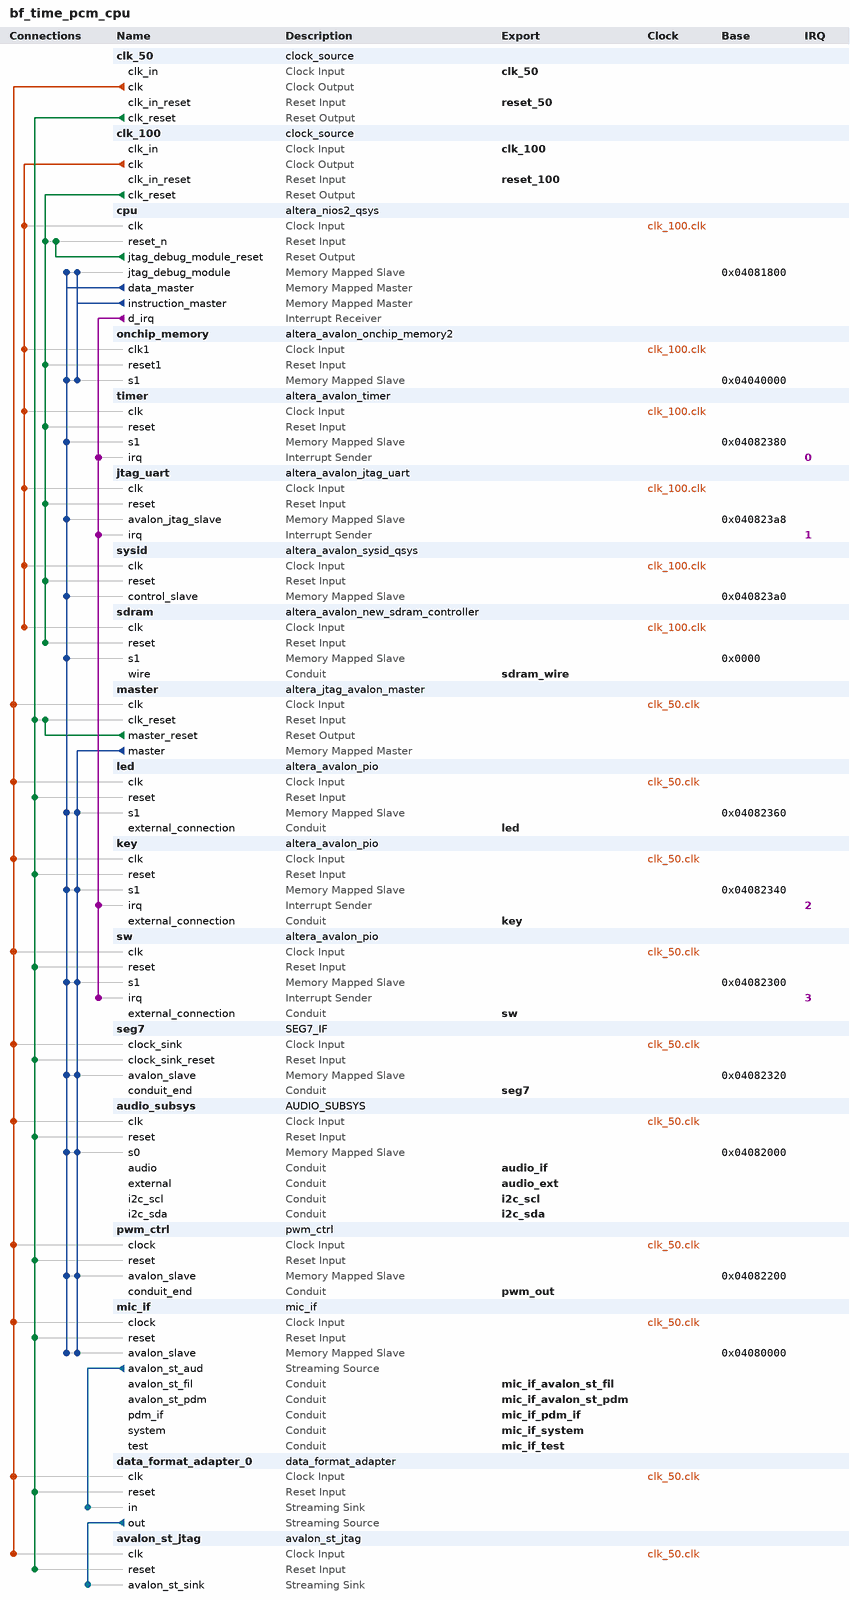
[diagram p0: system contents]
# Platform Designer (Qsys) system bf_time_pcm_cpu, Stratix III Unknown
# Parameters at their usual value, and those the tool derives, are not listed.
package require -exact qsys 13.0.1.99.2
create_system bf_time_pcm_cpu
set_project_property DEVICE_FAMILY {Stratix III}
set_project_property DEVICE Unknown

add_instance clk_50 clock_source 13.0
set_instance_parameter_value clk_50 clockFrequency 50000000

add_instance clk_100 clock_source 13.0
set_instance_parameter_value clk_100 clockFrequency 100000000

add_instance cpu altera_nios2_qsys 13.0
set_instance_parameter_value cpu resetSlave onchip_memory.s1
set_instance_parameter_value cpu mmu_TLBMissExcSlave None
set_instance_parameter_value cpu exceptionSlave onchip_memory.s1
set_instance_parameter_value cpu breakSlave cpu.jtag_debug_module
set_instance_parameter_value cpu muldiv_multiplierType NoneSmall
set_instance_parameter_value cpu impl Fast
set_instance_parameter_value cpu icache_size 4096

add_instance onchip_memory altera_avalon_onchip_memory2 13.0.1.99.2
set_instance_parameter_value onchip_memory dataWidth 32
set_instance_parameter_value onchip_memory dualPort false
set_instance_parameter_value onchip_memory initMemContent true
set_instance_parameter_value onchip_memory initializationFileName onchip_mem.hex
set_instance_parameter_value onchip_memory memorySize 160000

add_instance timer altera_avalon_timer 13.0.1.99.2
set_instance_parameter_value timer period 1
set_instance_parameter_value timer periodUnits MSEC

add_instance jtag_uart altera_avalon_jtag_uart 13.0.1.99.2
set_instance_parameter_value jtag_uart simInteractiveOptions NO_INTERACTIVE_WINDOWS

add_instance sysid altera_avalon_sysid_qsys 13.0
set_instance_parameter_value sysid id 0

add_instance sdram altera_avalon_new_sdram_controller 13.0.1.99.2
set_instance_parameter_value sdram TAC 5.5
set_instance_parameter_value sdram TRCD 20.0
set_instance_parameter_value sdram TRP 20.0
set_instance_parameter_value sdram casLatency 3
set_instance_parameter_value sdram columnWidth 10
set_instance_parameter_value sdram dataWidth 16
set_instance_parameter_value sdram generateSimulationModel true
set_instance_parameter_value sdram model single_Micron_MT48LC4M32B2_7_chip
set_instance_parameter_value sdram numberOfBanks 4
set_instance_parameter_value sdram numberOfChipSelects 1
set_instance_parameter_value sdram powerUpDelay 100.0
set_instance_parameter_value sdram refreshPeriod 15.625
set_instance_parameter_value sdram rowWidth 13

add_instance master altera_jtag_avalon_master 13.0

add_instance led altera_avalon_pio 13.0.1.99.2
set_instance_parameter_value led bitModifyingOutReg true
set_instance_parameter_value led direction Output
set_instance_parameter_value led width 32

add_instance key altera_avalon_pio 13.0.1.99.2
set_instance_parameter_value key bitModifyingOutReg true
set_instance_parameter_value key captureEdge true
set_instance_parameter_value key direction Input
set_instance_parameter_value key edgeType FALLING
set_instance_parameter_value key generateIRQ true
set_instance_parameter_value key irqType EDGE
set_instance_parameter_value key simDoTestBenchWiring true
set_instance_parameter_value key width 4

add_instance sw altera_avalon_pio 13.0.1.99.2
set_instance_parameter_value sw bitModifyingOutReg true
set_instance_parameter_value sw captureEdge true
set_instance_parameter_value sw direction Input
set_instance_parameter_value sw edgeType ANY
set_instance_parameter_value sw generateIRQ true
set_instance_parameter_value sw irqType EDGE
set_instance_parameter_value sw simDoTestBenchWiring true
set_instance_parameter_value sw width 10

add_instance seg7 SEG7_IF 1.0
set_instance_parameter_value seg7 SEG7_NUM 6

add_instance audio_subsys AUDIO_SUBSYS 1.0

add_instance pwm_ctrl pwm_ctrl 1.0
set_instance_parameter_value pwm_ctrl NUM_CH 2
set_instance_parameter_value pwm_ctrl CNT_WIDTH 32

add_instance mic_if mic_if 1.0
set_instance_parameter_value mic_if NUM_CH 4
set_instance_parameter_value mic_if NUM_TAPS 60
set_instance_parameter_value mic_if MAX_CICOSR 63
set_instance_parameter_value mic_if DATA_OUT_WIDTH 16
set_instance_parameter_value mic_if FFTPTS_WIDTH 11
set_instance_parameter_value mic_if BF_INP_PDM false
set_instance_parameter_value mic_if BF_TIME true

add_instance data_format_adapter_0 data_format_adapter 13.0
set_instance_parameter_value data_format_adapter_0 generationLanguage VERILOG
set_instance_parameter_value data_format_adapter_0 inBitsPerSymbol 8
set_instance_parameter_value data_format_adapter_0 inChannelWidth 0
set_instance_parameter_value data_format_adapter_0 inErrorWidth 0
set_instance_parameter_value data_format_adapter_0 inMaxChannel 0
set_instance_parameter_value data_format_adapter_0 inReadyLatency 0
set_instance_parameter_value data_format_adapter_0 inSymbolsPerBeat 2
set_instance_parameter_value data_format_adapter_0 inUseEmpty false
set_instance_parameter_value data_format_adapter_0 inUseEmptyPort AUTO
set_instance_parameter_value data_format_adapter_0 inUsePackets false
set_instance_parameter_value data_format_adapter_0 inUseReady true
set_instance_parameter_value data_format_adapter_0 outSymbolsPerBeat 1
set_instance_parameter_value data_format_adapter_0 outUseEmpty false
set_instance_parameter_value data_format_adapter_0 outUseEmptyPort AUTO

add_instance avalon_st_jtag avalon_st_jtag 1.0

# connections
add_connection clk_50.clk audio_subsys.clk clock
add_connection clk_50.clk avalon_st_jtag.clk clock
add_connection clk_50.clk data_format_adapter_0.clk clock
add_connection clk_50.clk key.clk clock
add_connection clk_50.clk led.clk clock
add_connection clk_50.clk master.clk clock
add_connection clk_50.clk mic_if.clock clock
add_connection clk_50.clk pwm_ctrl.clock clock
add_connection clk_50.clk seg7.clock_sink clock
add_connection clk_50.clk sw.clk clock
add_connection clk_100.clk cpu.clk clock
add_connection clk_100.clk jtag_uart.clk clock
add_connection clk_100.clk onchip_memory.clk1 clock
add_connection clk_100.clk sdram.clk clock
add_connection clk_100.clk sysid.clk clock
add_connection clk_100.clk timer.clk clock
add_connection clk_50.clk_reset audio_subsys.reset reset
add_connection clk_50.clk_reset avalon_st_jtag.reset reset
add_connection clk_50.clk_reset data_format_adapter_0.reset reset
add_connection clk_50.clk_reset key.reset reset
add_connection clk_50.clk_reset led.reset reset
add_connection clk_50.clk_reset master.clk_reset reset
add_connection clk_50.clk_reset mic_if.reset reset
add_connection clk_50.clk_reset pwm_ctrl.reset reset
add_connection clk_50.clk_reset seg7.clock_sink_reset reset
add_connection clk_50.clk_reset sw.reset reset
add_connection clk_100.clk_reset cpu.reset_n reset
add_connection clk_100.clk_reset jtag_uart.reset reset
add_connection clk_100.clk_reset onchip_memory.reset1 reset
add_connection clk_100.clk_reset sdram.reset reset
add_connection clk_100.clk_reset sysid.reset reset
add_connection clk_100.clk_reset timer.reset reset
add_connection cpu.jtag_debug_module_reset cpu.reset_n reset
add_connection master.master_reset master.clk_reset reset
add_connection cpu.data_master audio_subsys.s0 avalon
set_connection_parameter_value cpu.data_master/audio_subsys.s0 baseAddress 0x04082000
add_connection cpu.data_master cpu.jtag_debug_module avalon
set_connection_parameter_value cpu.data_master/cpu.jtag_debug_module baseAddress 0x04081800
add_connection cpu.data_master jtag_uart.avalon_jtag_slave avalon
set_connection_parameter_value cpu.data_master/jtag_uart.avalon_jtag_slave baseAddress 0x040823a8
add_connection cpu.data_master key.s1 avalon
set_connection_parameter_value cpu.data_master/key.s1 baseAddress 0x04082340
add_connection cpu.data_master led.s1 avalon
set_connection_parameter_value cpu.data_master/led.s1 baseAddress 0x04082360
add_connection cpu.data_master mic_if.avalon_slave avalon
set_connection_parameter_value cpu.data_master/mic_if.avalon_slave baseAddress 0x04080000
add_connection cpu.data_master onchip_memory.s1 avalon
set_connection_parameter_value cpu.data_master/onchip_memory.s1 baseAddress 0x04040000
add_connection cpu.data_master pwm_ctrl.avalon_slave avalon
set_connection_parameter_value cpu.data_master/pwm_ctrl.avalon_slave baseAddress 0x04082200
add_connection cpu.data_master sdram.s1 avalon
set_connection_parameter_value cpu.data_master/sdram.s1 baseAddress 0x0000
add_connection cpu.data_master seg7.avalon_slave avalon
set_connection_parameter_value cpu.data_master/seg7.avalon_slave baseAddress 0x04082320
add_connection cpu.data_master sw.s1 avalon
set_connection_parameter_value cpu.data_master/sw.s1 baseAddress 0x04082300
add_connection cpu.data_master sysid.control_slave avalon
set_connection_parameter_value cpu.data_master/sysid.control_slave baseAddress 0x040823a0
add_connection cpu.data_master timer.s1 avalon
set_connection_parameter_value cpu.data_master/timer.s1 baseAddress 0x04082380
add_connection cpu.instruction_master cpu.jtag_debug_module avalon
set_connection_parameter_value cpu.instruction_master/cpu.jtag_debug_module baseAddress 0x04081800
add_connection cpu.instruction_master onchip_memory.s1 avalon
set_connection_parameter_value cpu.instruction_master/onchip_memory.s1 baseAddress 0x04040000
add_connection master.master audio_subsys.s0 avalon
set_connection_parameter_value master.master/audio_subsys.s0 baseAddress 0x04082000
add_connection master.master key.s1 avalon
set_connection_parameter_value master.master/key.s1 baseAddress 0x04082340
add_connection master.master led.s1 avalon
set_connection_parameter_value master.master/led.s1 baseAddress 0x04082360
add_connection master.master mic_if.avalon_slave avalon
set_connection_parameter_value master.master/mic_if.avalon_slave baseAddress 0x04080000
add_connection master.master pwm_ctrl.avalon_slave avalon
set_connection_parameter_value master.master/pwm_ctrl.avalon_slave baseAddress 0x04082200
add_connection master.master seg7.avalon_slave avalon
set_connection_parameter_value master.master/seg7.avalon_slave baseAddress 0x04082320
add_connection master.master sw.s1 avalon
set_connection_parameter_value master.master/sw.s1 baseAddress 0x04082300
add_connection data_format_adapter_0.out avalon_st_jtag.avalon_st_sink avalon_streaming
add_connection mic_if.avalon_st_aud data_format_adapter_0.in avalon_streaming
add_connection cpu.d_irq jtag_uart.irq interrupt
set_connection_parameter_value cpu.d_irq/jtag_uart.irq irqNumber 1
add_connection cpu.d_irq key.irq interrupt
set_connection_parameter_value cpu.d_irq/key.irq irqNumber 2
add_connection cpu.d_irq sw.irq interrupt
set_connection_parameter_value cpu.d_irq/sw.irq irqNumber 3
add_connection cpu.d_irq timer.irq interrupt
set_connection_parameter_value cpu.d_irq/timer.irq irqNumber 0

# exported interfaces
add_interface audio_ext conduit end
set_interface_property audio_ext EXPORT_OF audio_subsys.external
add_interface audio_if conduit end
set_interface_property audio_if EXPORT_OF audio_subsys.audio
add_interface clk_100 clock sink
set_interface_property clk_100 EXPORT_OF clk_100.clk_in
add_interface clk_50 clock sink
set_interface_property clk_50 EXPORT_OF clk_50.clk_in
add_interface i2c_scl conduit end
set_interface_property i2c_scl EXPORT_OF audio_subsys.i2c_scl
add_interface i2c_sda conduit end
set_interface_property i2c_sda EXPORT_OF audio_subsys.i2c_sda
add_interface key conduit end
set_interface_property key EXPORT_OF key.external_connection
add_interface led conduit end
set_interface_property led EXPORT_OF led.external_connection
add_interface mic_if_avalon_st_pdm conduit end
set_interface_property mic_if_avalon_st_pdm EXPORT_OF mic_if.avalon_st_pdm
add_interface mic_if_pdm_if conduit end
set_interface_property mic_if_pdm_if EXPORT_OF mic_if.pdm_if
add_interface mic_if_system conduit end
set_interface_property mic_if_system EXPORT_OF mic_if.system
add_interface mic_if_test conduit end
set_interface_property mic_if_test EXPORT_OF mic_if.test
add_interface pwm_out conduit end
set_interface_property pwm_out EXPORT_OF pwm_ctrl.conduit_end
add_interface reset_100 reset sink
set_interface_property reset_100 EXPORT_OF clk_100.clk_in_reset
add_interface reset_50 reset sink
set_interface_property reset_50 EXPORT_OF clk_50.clk_in_reset
add_interface sdram_wire conduit end
set_interface_property sdram_wire EXPORT_OF sdram.wire
add_interface seg7 conduit end
set_interface_property seg7 EXPORT_OF seg7.conduit_end
add_interface sw conduit end
set_interface_property sw EXPORT_OF sw.external_connection
add_interface mic_if_avalon_st_fil conduit end
set_interface_property mic_if_avalon_st_fil EXPORT_OF mic_if.avalon_st_fil

set_interconnect_requirement {$system} qsys_mm.clockCrossingAdapter AUTO
set_interconnect_requirement {$system} qsys_mm.maxAdditionalLatency 1

save_system bf_time_pcm_cpu.qsys
